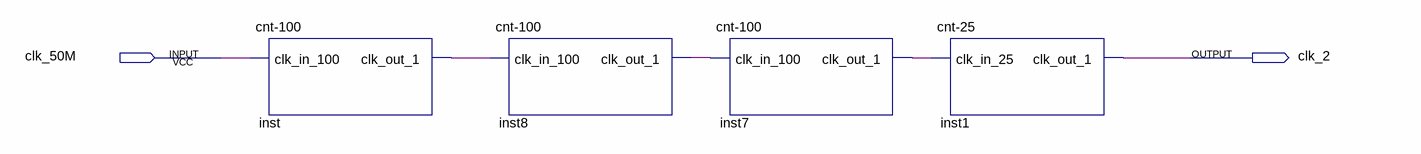
[diagram p0: schematic sheet]
// Quartus schematic clk_2.bdf as structural Verilog: 4 symbols, 2 pins
module clk_2 (
  input  clk_50M,
  output clk_2
);

  wire inst7_clk_out_1, inst8_clk_out_1, inst_clk_out_1;

  \cnt-100  inst (.clk_in_100(clk_50M), .clk_out_1(inst_clk_out_1));
  \cnt-100  inst8 (.clk_in_100(inst_clk_out_1), .clk_out_1(inst8_clk_out_1));
  \cnt-100  inst7 (.clk_in_100(inst8_clk_out_1), .clk_out_1(inst7_clk_out_1));
  \cnt-25  inst1 (.clk_in_25(inst7_clk_out_1), .clk_out_1(clk_2));
endmodule
